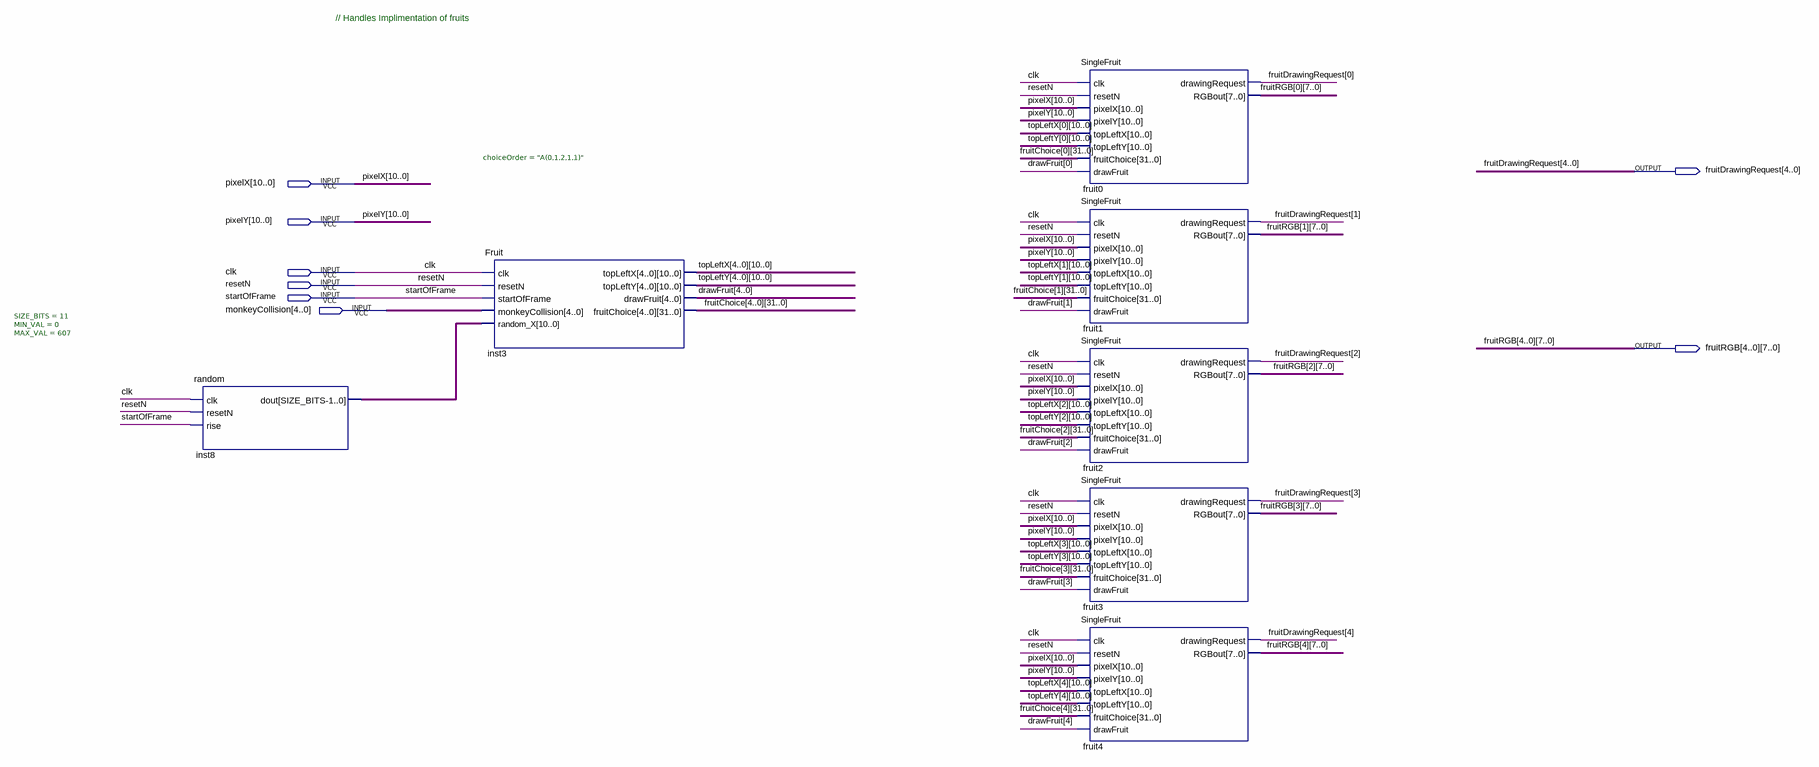
[diagram p0: schematic sheet]
// Quartus schematic Fruit_Display.bdf as structural Verilog: 7 symbols, 8 pins
module Fruit_Display (
  input  [10:0] pixelX,
  input  [10:0] pixelY,
  input  clk,
  input  resetN,
  input  startOfFrame,
  input  [4:0] monkeyCollision,
  output [4:0] fruitDrawingRequest,
  output [7:0] fruitRGB_4,
  output [7:0] fruitRGB_3,
  output [7:0] fruitRGB_2,
  output [7:0] fruitRGB_1,
  output [7:0] fruitRGB_0
);

  wire [4:0] drawFruit;
  wire [10:0] inst8_dout, topLeftX_0, topLeftX_1, topLeftX_2, topLeftX_3, topLeftX_4, topLeftY_0, topLeftY_1,
       topLeftY_2, topLeftY_3, topLeftY_4;
  wire [31:0] fruitChoice_0, fruitChoice_1, fruitChoice_2, fruitChoice_3, fruitChoice_4;

  random #(.SIZE_BITS(11), .MIN_VAL(0), .MAX_VAL(607)) inst8 (
    .clk(clk), .resetN(resetN), .rise(startOfFrame), .dout(inst8_dout));
  Fruit #(.choiceOrder("A(0,1,2,1,1)")) inst3 (
    .clk(clk), .resetN(resetN), .startOfFrame(startOfFrame), .monkeyCollision(monkeyCollision),
    .random_X(inst8_dout), .topLeftX({topLeftX_4, topLeftX_3, topLeftX_2, topLeftX_1, topLeftX_0}),
    .topLeftY({topLeftY_4, topLeftY_3, topLeftY_2, topLeftY_1, topLeftY_0}), .drawFruit(drawFruit),
    .fruitChoice({fruitChoice_4, fruitChoice_3, fruitChoice_2, fruitChoice_1, fruitChoice_0}));
  SingleFruit fruit0 (
    .clk(clk), .resetN(resetN), .pixelX(pixelX), .pixelY(pixelY), .topLeftX(topLeftX_0),
    .topLeftY(topLeftY_0), .fruitChoice(fruitChoice_0), .drawFruit(drawFruit[0]),
    .drawingRequest(fruitDrawingRequest[0]), .RGBout(fruitRGB_0));
  SingleFruit fruit1 (
    .clk(clk), .resetN(resetN), .pixelX(pixelX), .pixelY(pixelY), .topLeftX(topLeftX_1),
    .topLeftY(topLeftY_1), .fruitChoice(fruitChoice_1), .drawFruit(drawFruit[1]),
    .drawingRequest(fruitDrawingRequest[1]), .RGBout(fruitRGB_1));
  SingleFruit fruit2 (
    .clk(clk), .resetN(resetN), .pixelX(pixelX), .pixelY(pixelY), .topLeftX(topLeftX_2),
    .topLeftY(topLeftY_2), .fruitChoice(fruitChoice_2), .drawFruit(drawFruit[2]),
    .drawingRequest(fruitDrawingRequest[2]), .RGBout(fruitRGB_2));
  SingleFruit fruit3 (
    .clk(clk), .resetN(resetN), .pixelX(pixelX), .pixelY(pixelY), .topLeftX(topLeftX_3),
    .topLeftY(topLeftY_3), .fruitChoice(fruitChoice_3), .drawFruit(drawFruit[3]),
    .drawingRequest(fruitDrawingRequest[3]), .RGBout(fruitRGB_3));
  SingleFruit fruit4 (
    .clk(clk), .resetN(resetN), .pixelX(pixelX), .pixelY(pixelY), .topLeftX(topLeftX_4),
    .topLeftY(topLeftY_4), .fruitChoice(fruitChoice_4), .drawFruit(drawFruit[4]),
    .drawingRequest(fruitDrawingRequest[4]), .RGBout(fruitRGB_4));

  // Notes on the sheet:
  //   // Handles Implimentation of fruits
endmodule
